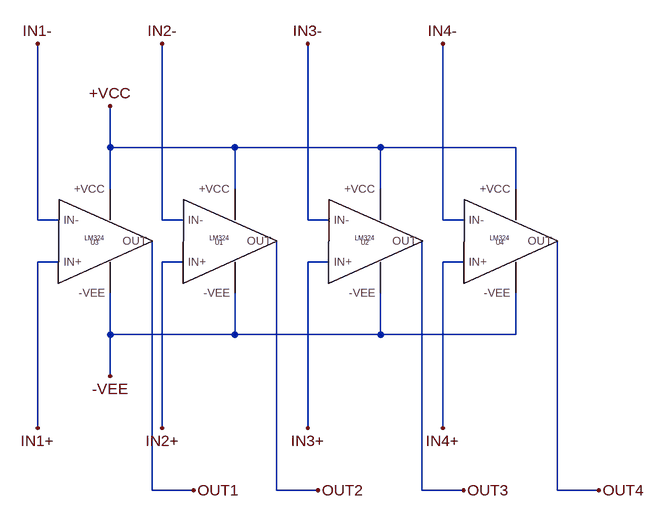
[diagram p0: schematic 4_channel_lm324_test_1.0.asc]
4_channel_lm324_test_1.0.asc, the LTspice schematic file:
Version 4.1
SHEET 1 880 680
WIRE -64 0 -64 -64
WIRE 128 0 -64 0
WIRE 352 0 128 0
WIRE 560 0 352 0
WIRE -64 64 -64 0
WIRE 128 64 128 0
WIRE 352 64 352 0
WIRE 560 64 560 0
WIRE -176 112 -176 -160
WIRE -144 112 -176 112
WIRE 16 112 16 -160
WIRE 48 112 16 112
WIRE 240 112 240 -160
WIRE 272 112 240 112
WIRE 448 112 448 -160
WIRE 480 112 448 112
WIRE -144 176 -176 176
WIRE 48 176 16 176
WIRE 272 176 240 176
WIRE 480 176 448 176
WIRE -64 288 -64 224
WIRE 128 288 128 224
WIRE 128 288 -64 288
WIRE 352 288 352 224
WIRE 352 288 128 288
WIRE 560 288 560 224
WIRE 560 288 352 288
WIRE -64 352 -64 288
WIRE -176 432 -176 176
WIRE 16 432 16 176
WIRE 240 432 240 176
WIRE 448 432 448 176
WIRE 0 528 0 144
WIRE 64 528 0 528
WIRE 192 528 192 144
WIRE 256 528 192 528
WIRE 416 528 416 144
WIRE 480 528 416 528
WIRE 624 528 624 144
WIRE 688 528 624 528
FLAG -176 -160 IN1-
FLAG -176 432 IN1+
FLAG -64 352 -VEE
FLAG -64 -64 +VCC
FLAG 16 -160 IN2-
FLAG 240 432 IN3+
FLAG 240 -160 IN3-
FLAG 448 -160 IN4-
FLAG 16 432 IN2+
FLAG 448 432 IN4+
FLAG 64 528 OUT1
FLAG 256 528 OUT2
FLAG 480 528 OUT3
FLAG 688 528 OUT4
SYMBOL LM324 96 144 R0
SYMATTR InstName U1
SYMBOL LM324 320 144 R0
SYMATTR InstName U2
SYMBOL LM324 -96 144 R0
SYMATTR InstName U3
SYMBOL LM324 528 144 R0
SYMATTR InstName U4

The netlist it stands for:
* 4_channel_lm324_test_1.0.asc
X§U1 IN2+ IN2- +VCC -VEE OUT2 LM324  ; pins IN+ IN- +VCC -VEE OUT
X§U2 IN3+ IN3- +VCC -VEE OUT3 LM324  ; pins IN+ IN- +VCC -VEE OUT
X§U3 IN1+ IN1- +VCC -VEE OUT1 LM324  ; pins IN+ IN- +VCC -VEE OUT
X§U4 IN4+ IN4- +VCC -VEE OUT4 LM324  ; pins IN+ IN- +VCC -VEE OUT
.lib C:\Users\hidde\Documents\Datasheets\LTspice models\sglm009d\lmx24_lm2902.lib
.backanno
.end